# EAGLE schematic MB85RC1MT (EAGLE 9.6.2)
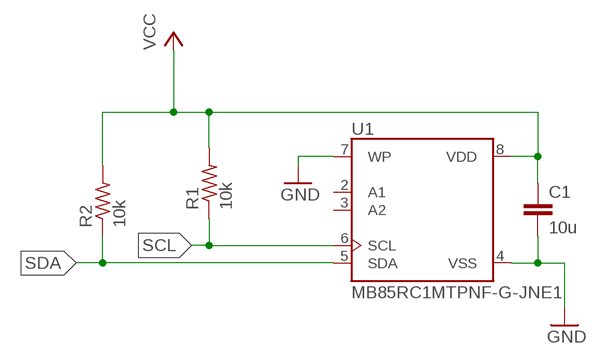
[diagram p0: schematic, sheet 1]

## Parts
C1  10u  C-EUC0603  [C0603]
R1  10k  R-US_R0603  [R0603]
R2  10k  R-US_R0603  [R0603]
U1  MB85RC1MTPNF-G-JNE1  [SOIC127P620X175-8N]

## Nets
GND: C1.2 U1.4(VSS) U1.7(WP)
SCL: R1.1 U1.6(SCL)
SDA: R2.1 U1.5(SDA)
VCC: C1.1 R1.2 R2.2 U1.8(VDD)
Unconnected: U1.2(A1) U1.3(A2)

## Library data of the parts
C1 = rcl:C-EU: CAPACITOR, European symbol; SPICEPREFIX: C
R1 R2 = rcl:R-US_: RESISTOR, American symbol; SPICEPREFIX: R
U1 = MB85RC1MTPNF-G-JNE1:MB85RC1MTPNF-G-JNE1: Fujitsu MB85RC1MTPNF-G-JNE1 1M Bit FRAM LSI I2C Serial Interface Check prices <https://pricing.snapeda.com/parts/MB85RC1MTPNF-G-JNE1/Fujitsu/view-part?ref=eda>; AVAILABILITY: Bad; DESCRIPTION: F-RAM 1Mbit FRAM, I2C, BULK; MF: Fujitsu; MP: MB85RC1MTPNF-G-JNE1; PACKAGE: None; PRICE: None